# Altium schematic sheet power_supply_switching.SchDoc: Switching regulators
size 297 x 209 mm; CheckedBy: MC, TW, EB; CompanyName: CERN; DrawnBy: Greg Kasprowicz; Organization: CERN; Address1: European Organization for Nuclear Research; Address2: CH-1211 Geneve 23 - Switzerland; DocumentNumber: 15; Revision: -; SheetNumber: 15; SheetTotal: 17; EDA_Number: EDA-02189-V4-0; Projet: Simple PCIe Carrier Board; ModifiedBy: TW, MC; CreateDate: 10/07/2010; CheckedDate: 11/05/2011; Title2: 3.3V, 2.5V, 1.8V and 1.2V; DivGrp: BE-CO; Designer: GK, MC, TW, EB, PAS; ModifiedDate: -
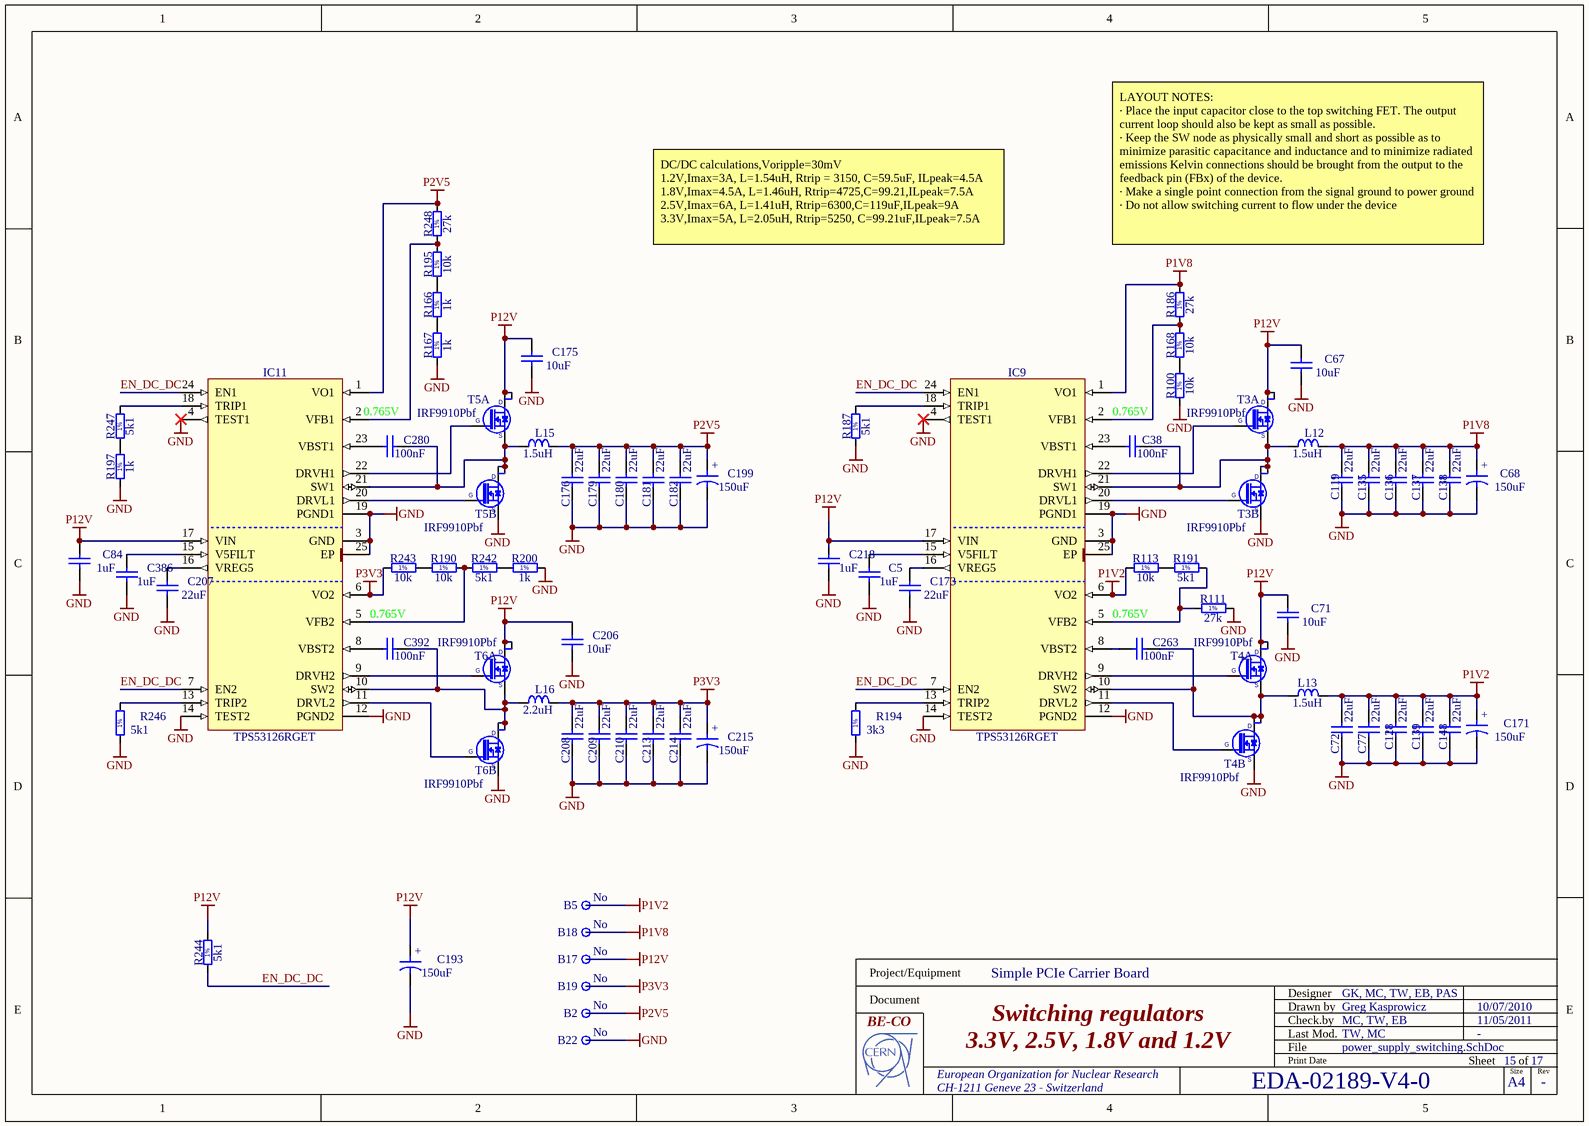
[diagram p0: power_supply_switching.SchDoc]

## Parts
B2  Mounted: No  [VERO_20-2136]  (hidden comment: Test Point)
B5  Mounted: No  [VERO_20-2136]  (hidden comment: Test Point)
B17  Mounted: No  [VERO_20-2136]  (hidden comment: Test Point)
B18  Mounted: No  [VERO_20-2136]  (hidden comment: Test Point)
B19  Mounted: No  [VERO_20-2136]  (hidden comment: Test Point)
B22  Mounted: No  [VERO_20-2136]  (hidden comment: Test Point)
C5  1uF  [CAPC1608X87N]
C38  100nF  [CAPC1608X87N]
C67  10uF  [CAPC3225X270N]
C68  150uF  [CAPPR350-850X700]
C71  10uF  [CAPC3225X270N]
C72  22uF  [CAPC3216X180N]
C77  22uF  [CAPC3216X180N]
C84  1uF  [CAPC1608X87N]
C119  22uF  [CAPC3216X180N]
C128  22uF  [CAPC3216X180N]
C135  22uF  [CAPC3216X180N]
C136  22uF  [CAPC3216X180N]
C137  22uF  [CAPC3216X180N]
C138  22uF  [CAPC3216X180N]
C139  22uF  [CAPC3216X180N]
C148  22uF  [CAPC3216X180N]
C171  150uF  [CAPPR350-850X700]
C173  22uF  [CAPC3216X180N]
C175  10uF  [CAPC3225X270N]
C176  22uF  [CAPC3216X180N]
C179  22uF  [CAPC3216X180N]
C180  22uF  [CAPC3216X180N]
C181  22uF  [CAPC3216X180N]
C182  22uF  [CAPC3216X180N]
C193  150uF  [CAPPR500-1050X800]
C199  150uF  [CAPPR350-850X700]
C206  10uF  [CAPC3225X270N]
C207  22uF  [CAPC3216X180N]
C208  22uF  [CAPC3216X180N]
C209  22uF  [CAPC3216X180N]
C210  22uF  [CAPC3216X180N]
C213  22uF  [CAPC3216X180N]
C214  22uF  [CAPC3216X180N]
C215  150uF  [CAPPR350-850X700]
C218  1uF  [CAPC1608X87N]
C263  100nF  [CAPC1608X87N]
C280  100nF  [CAPC1608X87N]
C386  1uF  [CAPC1608X87N]
C392  100nF  [CAPC1608X87N]
IC9  TPS53126RGET  [QFN50P400X400X100-25N-S255]
IC11  TPS53126RGET  [QFN50P400X400X100-25N-S255]
L12  1.5uH  [IND_BOURNS_SRR1260]
L13  1.5uH  [IND_BOURNS_SRR1260]
L15  1.5uH  [IND_BOURNS_SRR1260]
L16  2.2uH  [IND_BOURNS_SRR1260]
R100  10k  [RESC1608X55N]
R111  27k  [RESC1608X55N]
R113  10k  [RESC1608X55N]
R166  1k  [RESC1608X55N]
R167  1k  [RESC1608X55N]
R168  10k  [RESC1608X55N]
R186  27k  [RESC1608X55N]
R187  5k1  [RESC1608X55N]
R190  10k  [RESC1608X55N]
R191  5k1  [RESC1608X55N]
R194  3k3  [RESC1608X55N]
R195  10k  [RESC1608X55N]
R197  1k  [RESC1608X55N]
R200  1k  [RESC1608X55N]
R242  5k1  [RESC1608X55N]
R243  10k  [RESC1608X55N]
R244  5k1  [RESC1608X55N]
R246  5k1  [RESC1608X55N]
R247  5k1  [RESC1608X55N]
R248  27k  [RESC1608X55N]
T3  IRF9910Pbf  [SOIC127P600X175-8N]  (parts A,B of 2)
T4  IRF9910Pbf  [SOIC127P600X175-8N]  (parts A,B of 2)
T5  IRF9910Pbf  [SOIC127P600X175-8N]  (parts A,B of 2)
T6  IRF9910Pbf  [SOIC127P600X175-8N]  (parts A,B of 2)

## Nets
GND: B22.1 C5.1 C67.2 C68.2 C71.2 C72.1 C77.1 C84.2 C119.1 C128.1 C135.1 C136.1 C137.1 C138.1 C139.1 C148.1 C171.2 C173.1 C175.2 C176.1 C179.1 C180.1 C181.1 C182.1 C193.2 C199.2 C206.2 C207.1 C208.1 C209.1 C210.1 C213.1 C214.1 C215.2 C218.1 C386.1 IC9.3(GND) IC9.4(TEST1) IC9.12(PGND2) IC9.14(TEST2) IC9.19(PGND1) IC9.25(EP) IC11.3(GND) IC11.4(TEST1) IC11.12(PGND2) IC11.14(TEST2) IC11.19(PGND1) IC11.25(EP) R100.1 R111.2 R167.1 R187.1 R194.1 R197.1 R200.2 R246.1 T3.1(S) T4.1(S) T5.1(S) T6.1(S)
P1V2: B5.1 C72.2 C77.2 C128.2 C139.2 C148.2 C171.1 IC9.6(VO2) L13.2 R113.1
P1V8: B18.1 C68.1 C119.2 C135.2 C136.2 C137.2 C138.2 IC9.1(VO1) L12.2 R186.2
P2V5: B2.1 C176.2 C179.2 C180.2 C181.2 C182.2 C199.1 IC11.1(VO1) L15.2 R248.2
P3V3: B19.1 C208.2 C209.2 C210.2 C213.2 C214.2 C215.1 IC11.6(VO2) L16.2 R243.1
P12V: B17.1 C67.1 C71.1 C84.1 C175.1 C193.1 C206.1 C218.2 IC9.17(VIN) IC11.17(VIN) R244.2 T3.5(D) T3.6(D) T4.5(D) T4.6(D) T5.5(D) T5.6(D) T6.5(D) T6.6(D)
EN_DC_DC: IC9.7(EN2) IC9.24(EN1) IC11.7(EN2) IC11.24(EN1) R244.1
NetC5_2: C5.2 IC9.15(V5FILT)
NetC38_1: C38.1 IC9.21(SW1) L12.1 T3.3(S) T3.7(D) T3.8(D)
NetC38_2: C38.2 IC9.23(VBST1)
NetC173_2: C173.2 IC9.16(VREG5)
NetC207_2: C207.2 IC11.16(VREG5)
NetC263_1: C263.1 IC9.10(SW2) L13.1 T4.3(S) T4.7(D) T4.8(D)
NetC263_2: C263.2 IC9.8(VBST2)
NetC280_1: C280.1 IC11.21(SW1) L15.1 T5.3(S) T5.7(D) T5.8(D)
NetC280_2: C280.2 IC11.23(VBST1)
NetC386_2: C386.2 IC11.15(V5FILT)
NetC392_1: C392.1 IC11.10(SW2) L16.1 T6.3(S) T6.7(D) T6.8(D)
NetC392_2: C392.2 IC11.8(VBST2)
NetIC9_2: IC9.2(VFB1) R168.2 R186.1
NetIC9_5: IC9.5(VFB2) R111.1 R191.2
NetIC9_9: IC9.9(DRVH2) T4.4(G)
NetIC9_11: IC9.11(DRVL2) T4.2(G)
NetIC9_13: IC9.13(TRIP2) R194.2
NetIC9_18: IC9.18(TRIP1) R187.2
NetIC9_20: IC9.20(DRVL1) T3.2(G)
NetIC9_22: IC9.22(DRVH1) T3.4(G)
NetIC11_2: IC11.2(VFB1) R195.2 R248.1
NetIC11_5: IC11.5(VFB2) R190.2 R242.1
NetIC11_9: IC11.9(DRVH2) T6.4(G)
NetIC11_11: IC11.11(DRVL2) T6.2(G)
NetIC11_13: IC11.13(TRIP2) R246.2
NetIC11_18: IC11.18(TRIP1) R247.2
NetIC11_20: IC11.20(DRVL1) T5.2(G)
NetIC11_22: IC11.22(DRVH1) T5.4(G)
NetR100_2: R100.2 R168.1
NetR113_2: R113.2 R191.1
NetR166_1: R166.1 R167.2
NetR166_2: R166.2 R195.1
NetR190_1: R190.1 R243.2
NetR197_2: R197.2 R247.1
NetR200_1: R200.1 R242.2

## Notes on the sheet
- DC/DC calculations,Voripple=30mV
  1.2V,Imax=3A, L=1.54uH, Rtrip = 3150, C=59.5uF, ILpeak=4.5A
  1.8V,Imax=4.5A, L=1.46uH, Rtrip=4725,C=99.21,ILpeak=7.5A
  2.5V,Imax=6A, L=1.41uH, Rtrip=6300,C=119uF,ILpeak=9A
  3.3V,Imax=5A, L=2.05uH, Rtrip=5250, C=99.21uF,ILpeak=7.5A
- (near R186) LAYOUT NOTES:
  · Place the input capacitor close to the top switching FET. The output current loop should also be kept as small as possible.
  · Keep the SW node as physically small and short as possible as to minimize parasitic capacitance and inductance and to minimize radiated emissions Kelvin connections should be brought from the output to the feedback pin (FBx) of the device.
  · Make a single point connection from the signal ground to power ground
  · Do not allow switching current to flow under the device
- 0.765V
- Project/Equipment
- Document
- Designer
- Drawn by
- Check.by
- File
- Last Mod.
- Print Date
- Sheet
- Size
- A4
- of
- Rev
- (in symbol CAER_150UF_6.3V_20%_SANYO_6SEQP150M) +
- (in symbol CAER_150UF_16V_20%_SANYO_16SEQP150M) +
- (in symbol R0603_1K_1%_0.1W_100PPM) 1%
- (in symbol R0603_3K3_1%_0.1W_100PPM) 1%
- (in symbol R0603_5K1_1%_0.1W_100PPM) 1%
- (in symbol R0603_10K_1%_0.1W_100PPM) 1%
- (in symbol R0603_27K_1%_0.1W_100PPM) 1%

## Library data of the parts
B2 B5 B17-B19 B22 = VERO_20-2136: Single Terminal Socket; Part Description: Black Bead PCB Terminal Test Pin (1.32 mm hole); Manufacturer: VERO TECHNOLOGIES; Table: Miscellaneous; Part Number: VERO_20-2136; Component Kind: Standard; Component Type: Standard; Pin Count: 1; Family: Test Point; Socket: No; SMD: No; Status: None; Manufacturer Part Number: 20-2136; ComponentHeight: 5.3mm; HelpURL: \\cern.ch\dfs\Applications\Altium\Datasheets\VERO_20-2136.pdf; Author: CERN DEM JLC; CreateDate: 21/07/2008; LatestRevisionDate: 21/07/2008
C5 C84 C218 C386 = CC0603_1UF_16V_10%_X7R: Non-polarised capacitor; Part Description: SMD Multilayer Chip Ceramic Capacitor; Manufacturer: GENERIC; Manufacturer1 Part Number: 223824613663; Voltage: 16V; TC: X7R; Tolerance: ±10%; Table: Capacitors SMD; Part Number: CC0603_1UF_16V_10%_X7R; Component Kind: Standard; Component Type: Standard; Pin Count: 2; Value: 1uF; Status: Preferred; Manufacturer Part Number: CC0603_1uF_16V_10%_X7R; Case: 0603; Mounted: Yes; Socket: No; SMD: Yes; Manufacturer1 Example: PHYCOMP; Manufacturer1 ComponentHeight: 0.87mm; HelpURL: \\cern.ch\dfs\Applications\Altium\Datasheets\CC0805_X5R_PHYCOMP_HC.pdf; Author: CERN DEM JLC
  C5 C386: CreateDate: 03/12/2007; LatestRevisionDate: 03/12/2007
  C84 C218: CreateDate: 12/3/2007; LatestRevisionDate: 12/3/2007
C38 C263 C280 C392 = CC0603_100NF_50V_10%_X7R: Non-polarised capacitor; Part Description: SMD Multilayer Chip Ceramic Capacitor; Manufacturer: GENERIC; Manufacturer1 Part Number: 223858615649; Voltage: 50V; TC: X7R; Tolerance: ±10%; Table: Capacitors SMD; Part Number: CC0603_100NF_50V_10%_X7R; Component Kind: Standard; Component Type: Standard; Pin Count: 2; Value: 100nF; Status: Preferred; Manufacturer Part Number: CC0603_100NF_50V_10%_X7R; Case: 0603; Mounted: Yes; Socket: No; SMD: Yes; Manufacturer1 Example: PHYCOMP; Manufacturer1 ComponentHeight: 0.87mm; HelpURL: \\cern.ch\dfs\Applications\Altium\Datasheets\CC0603_X7R_PHYCOMP.pdf; Author: CERN DEM JLC; CreateDate: 2007-12-03; LatestRevisionDate: 2007-12-03
C67 C71 C175 C206 = CC1210_10UF_25V_10%_X7R: Non-polarised capacitor; Part Description: SMD Multilayer Chip Ceramic Capacitor; Manufacturer: GENERIC; Manufacturer1 Part Number: C1210C106K3RAC; Voltage: 25V; TC: X7R; Tolerance: ±10%; Table: Capacitors SMD; Part Number: CC1210_10UF_25V_10%_X7R; Component Kind: Standard; Component Type: Standard; Pin Count: 2; Value: 10uF; Status: None; Manufacturer Part Number: CC1210_10UF_25V_10%_X7R; Case: 1210; Mounted: Yes; Socket: No; SMD: Yes; Manufacturer1 Example: KEMET; Manufacturer1 ComponentHeight: 2.7mm; HelpURL: \\cern.ch\dfs\Applications\Altium\Datasheets\CC1210_X7R_KEMET.pdf; Author: CERN DEM JLC; CreateDate: 5/5/2009; LatestRevisionDate: 4/1/2010
C68 C171 C199 C215 = CAER_150UF_6.3V_20%_SANYO_6SEQP150M: Polarised capacitor; Part Description: Aluminium Solid Capacitor With Conductive Polymer (SEQP Serie); Manufacturer: SANYO OS-CON; Voltage: 6.3V; Tolerance: ±20%; Table: Capacitors THD; Part Number: CAER_150UF_6.3V_20%_SANYO_6SEQP150M; Component Kind: Standard; Component Type: Standard; Pin Count: 2; Value: 150uF; Status: Not Recommended; Manufacturer Part Number: 6SEQP150M; Case: LS3.5 D8 x H7; Mounted: Yes; Socket: No; SMD: No; ComponentHeight: 7mm; HelpURL: \\cern.ch\dfs\Applications\Altium\Datasheets\CAER_SANYO_SEQP.pdf; Author: CERN DEM JLC; CreateDate: 3/7/2011; LatestRevisionDate: 3/7/2011
C72 C77 C119 C128 C135-C139 C148 C173 C176 C179-C182 C207-C210 C213 C214 = CC1206_22UF_10V_10%_X7R: Non-polarised capacitor; Part Description: SMD Multilayer Chip Ceramic Capacitor; Manufacturer: GENERIC; Manufacturer1 Part Number: GRM31CR71A226KE15L; Voltage: 10V; TC: X7R; Tolerance: ±10%; Table: Capacitors SMD; Part Number: CC1206_22UF_10V_10%_X7R; Component Kind: Standard; Component Type: Standard; Pin Count: 2; Value: 22uF; Status: Preferred; Manufacturer Part Number: CC1206_22UF_10V_10%_X7R; Case: 1206; Mounted: Yes; Socket: No; SMD: Yes; Manufacturer1 Example: MURATA; Manufacturer1 ComponentHeight: 1.8mm; HelpURL: \\cern.ch\dfs\Applications\Altium\Datasheets\CC1206_X7R_MURATA_GRM-HI-CAP.pdf; Author: CERN DEM JLC; CreateDate: 2010-06-08; LatestRevisionDate: 2010-06-08
C193 = CAER_150UF_16V_20%_SANYO_16SEQP150M: Polarised capacitor; Part Description: Aluminium Solid Capacitor With Conductive Polymer (SEQP Serie); Manufacturer: SANYO OS-CON; Voltage: 16V; Tolerance: ±20%; Table: Capacitors THD; Part Number: CAER_150UF_16V_20%_SANYO_16SEQP150M; Component Kind: Standard; Component Type: Standard; Pin Count: 2; Value: 150uF; Status: Not Recommended; Manufacturer Part Number: 16SEQP150M; Case: LS5 D10 x H8; Mounted: Yes; Socket: No; SMD: No; ComponentHeight: 8mm; HelpURL: \\cern.ch\dfs\Applications\Altium\Datasheets\CAER_SANYO_SEQP.pdf; Author: CERN DEM JLC; CreateDate: 3/7/2011; LatestRevisionDate: 3/7/2011
IC9 IC11 = TPS53126RGET: Dual Synchronous Step-Down Controller For Low Voltage Power Rails; Manufacturer: TEXAS INSTRUMENTS; Table: Analog & Interface; Part Number: TPS53126RGET; Component Kind: Standard; Component Type: Standard; Device: TPS53126RGET; PackageDescription: QFN,0.50mm pitch,square;6 pin X 6 pin,4.15mm X 4.15mm X 1.00mm H body (w/thermal tab 2.55 X 2.55mm),  IPC Medium Density; Part Description: Dual Synchronous Step-Down Controller For Low Voltage Power Rails; Manufacturer Part Number: TPS53126RGET; Pin Count: 25; Case: QFN24; Mounted: Yes; Socket: No; SMD: Yes; ComponentHeight: 1.0mm; Author: CERN DEM JLC; HelpURL: \\cern.ch\dfs\Applications\Altium\Datasheets\TPS53126RGET.pdf; CreateDate: 2010-08-26; LatestRevisionDate: 2010-08-26
L12 L13 L15 = IND_1.5UH_30%_BOURNS_SRR1260: Inductor; Part Description: Shielded SMD Power Inductors; Manufacturer: BOURNS; Manufacturer Part Number: SRR1260-1R5Y; Power: 8.8A; Resistance: 0.0095R; Tolerance: ±30%; Table: Inductors SMD; Part Number: IND_1.5UH_30%_BOURNS_SRR1260; Component Kind: Standard; Component Type: Standard; Pin Count: 2; Value: 1.5uH; Status: None; Mounted: Yes; Socket: No; SMD: Yes; ComponentHeight: 6.5mm; HelpURL: \\cern.ch\dfs\Applications\Altium\Datasheets\IND_BOURNS_SRR1260.pdf; Author: CERN DEM JLC; CreateDate: 2010-08-30; LatestRevisionDate: 2010-08-30
L16 = IND_2.2UH_30%_BOURNS_SRR1260: Inductor; Part Description: Shielded SMD Power Inductors; Manufacturer: BOURNS; Manufacturer Part Number: SRR1260-2R2Y; Power: 8.2A; Resistance: 0.0105R; Tolerance: ±30%; Table: Inductors SMD; Part Number: IND_2.2UH_30%_BOURNS_SRR1260; Component Kind: Standard; Component Type: Standard; Pin Count: 2; Value: 2.2uH; Status: None; Mounted: Yes; Socket: No; SMD: Yes; ComponentHeight: 6.5mm; HelpURL: \\cern.ch\dfs\Applications\Altium\Datasheets\IND_BOURNS_SRR1260.pdf; Author: CERN DEM JLC; CreateDate: 2010-08-30; LatestRevisionDate: 2010-08-30
R100 R113 R168 R190 R195 R243 = R0603_10K_1%_0.1W_100PPM: Resistor - 1%; Part Description: General Purpose Thick Film Chip Resistor; Manufacturer: GENERIC; Manufacturer1 Part Number: NRC06F1002TRF; Power: 0.1W; TC: ±100ppm/°C; Table: Resistors SMD; Part Number: R0603_10K_1%_0.1W_100PPM; Component Kind: Standard; Component Type: Standard; Pin Count: 2; Value: 10k; Status: Preferred; Tolerance: ±1%; Manufacturer Part Number: R0603_10K_1%_0.1W_100PPM; Case: 0603; Mounted: Yes; Socket: No; SMD: Yes; Manufacturer1 Example: NIC COMPONENT; Manufacturer1 ComponentHeight: 0.55mm; HelpURL: \\cern.ch\dfs\Applications\Altium\Datasheets\R0603_NIC_NRC.pdf; Author: CERN DEM JLC; CreateDate: 12/3/2007; LatestRevisionDate: 3/13/2008
R111 R186 R248 = R0603_27K_1%_0.1W_100PPM: Resistor - 1%; Part Description: General Purpose Thick Film Chip Resistor; Manufacturer: GENERIC; Manufacturer1 Part Number: NRC06F2702TRF; Power: 0.1W; TC: ±100ppm/°C; Table: Resistors SMD; Part Number: R0603_27K_1%_0.1W_100PPM; Component Kind: Standard; Component Type: Standard; Pin Count: 2; Value: 27k; Status: Preferred; Tolerance: ±1%; Manufacturer Part Number: R0603_27K_1%_0.1W_100PPM; Case: 0603; Mounted: Yes; Socket: No; SMD: Yes; Manufacturer1 Example: NIC COMPONENT; Manufacturer1 ComponentHeight: 0.55mm; HelpURL: \\cern.ch\dfs\Applications\Altium\Datasheets\R0603_NIC_NRC.pdf; Author: CERN DEM JLC; CreateDate: 12/3/2007; LatestRevisionDate: 3/13/2008
R166 R167 R197 R200 = R0603_1K_1%_0.1W_100PPM: Resistor - 1%; Part Description: General Purpose Thick Film Chip Resistor; Manufacturer: GENERIC; Manufacturer1 Part Number: NRC06F1001TRF; Power: 0.1W; TC: ±100ppm/°C; Table: Resistors SMD; Part Number: R0603_1K_1%_0.1W_100PPM; Component Kind: Standard; Component Type: Standard; Pin Count: 2; Value: 1k; Status: Preferred; Tolerance: ±1%; Manufacturer Part Number: R0603_1K_1%_0.1W_100PPM; Case: 0603; Mounted: Yes; Socket: No; SMD: Yes; Manufacturer1 Example: NIC COMPONENT; Manufacturer1 ComponentHeight: 0.55mm; HelpURL: \\cern.ch\dfs\Applications\Altium\Datasheets\R0603_NIC_NRC.pdf; Author: CERN DEM JLC; CreateDate: 12/3/2007; LatestRevisionDate: 3/13/2008
R187 R191 R242 R244 R246 R247 = R0603_5K1_1%_0.1W_100PPM: Resistor - 1%; Part Description: General Purpose Thick Film Chip Resistor; Manufacturer: GENERIC; Manufacturer1 Part Number: NRC06F5101TRF; Power: 0.1W; TC: ±100ppm/°C; Table: Resistors SMD; Part Number: R0603_5K1_1%_0.1W_100PPM; Component Kind: Standard; Component Type: Standard; Pin Count: 2; Value: 5k1; Status: Preferred; Tolerance: ±1%; Manufacturer Part Number: R0603_5K1_1%_0.1W_100PPM; Case: 0603; Mounted: Yes; Socket: No; SMD: Yes; Manufacturer1 Example: NIC COMPONENT; Manufacturer1 ComponentHeight: 0.55mm; HelpURL: \\cern.ch\dfs\Applications\Altium\Datasheets\R0603_NIC_NRC.pdf; Author: CERN DEM JLC
  R187 R191 R242 R244 R247: CreateDate: 12/3/2007; LatestRevisionDate: 3/13/2008
  R246: CreateDate: 2007-12-03; LatestRevisionDate: 2008-03-13
R194 = R0603_3K3_1%_0.1W_100PPM: Resistor - 1%; Part Description: General Purpose Thick Film Chip Resistor; Manufacturer: GENERIC; Manufacturer1 Part Number: NRC06F3301TRF; Power: 0.1W; TC: ±100ppm/°C; Table: Resistors SMD; Part Number: R0603_3K3_1%_0.1W_100PPM; Component Kind: Standard; Component Type: Standard; Pin Count: 2; Value: 3k3; Status: Preferred; Tolerance: ±1%; Manufacturer Part Number: R0603_3K3_1%_0.1W_100PPM; Case: 0603; Mounted: Yes; Socket: No; SMD: Yes; Manufacturer1 Example: NIC COMPONENT; Manufacturer1 ComponentHeight: 0.55mm; HelpURL: \\cern.ch\dfs\Applications\Altium\Datasheets\R0603_NIC_NRC.pdf; Author: CERN DEM JLC; CreateDate: 2007-12-03; LatestRevisionDate: 2008-03-13
T3-T6 = IRF9910Pbf: Dual SO-8 MOSFET For POL Cconverter; Part Description: 20V 10A(Q1) 20V 12A (Q2) Dual SO-8 MOSFET For POL Cconverter; Manufacturer: INTERNATIONAL RECTIFIER; Table: Transistors; Part Number: IRF9910Pbf; Component Kind: Standard; Component Type: Standard; Device: IRF9910Pbf; PackageDescription: SOIC 8, Pitch 1.27mm - Body 4x5mm, IPC Medium Density; Manufacturer Part Number: IRF9910Pbf; Pin Count: 8; Case: DO8; Mounted: Yes; Socket: No; SMD: Yes; ComponentHeight: 1.75mm; HelpURL: \\cern.ch\dfs\Applications\Altium\Datasheets\IRF9910Pbf.pdf; Author: CERN DEM JLC; CreateDate: 2010-08-30; LatestRevisionDate: 2010-08-30